# Altium schematic sheet Y2.SchDoc
size A1; SheetNumber: 1; SheetTotal: 1
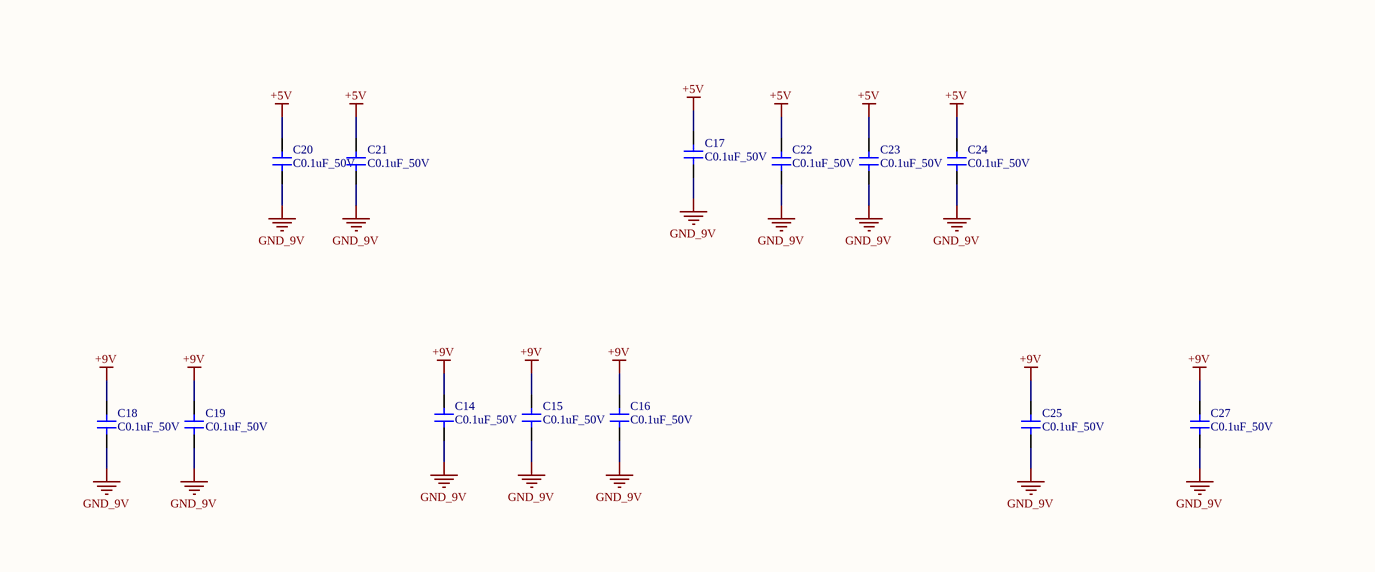
[diagram p0: Y2.SchDoc, top left]
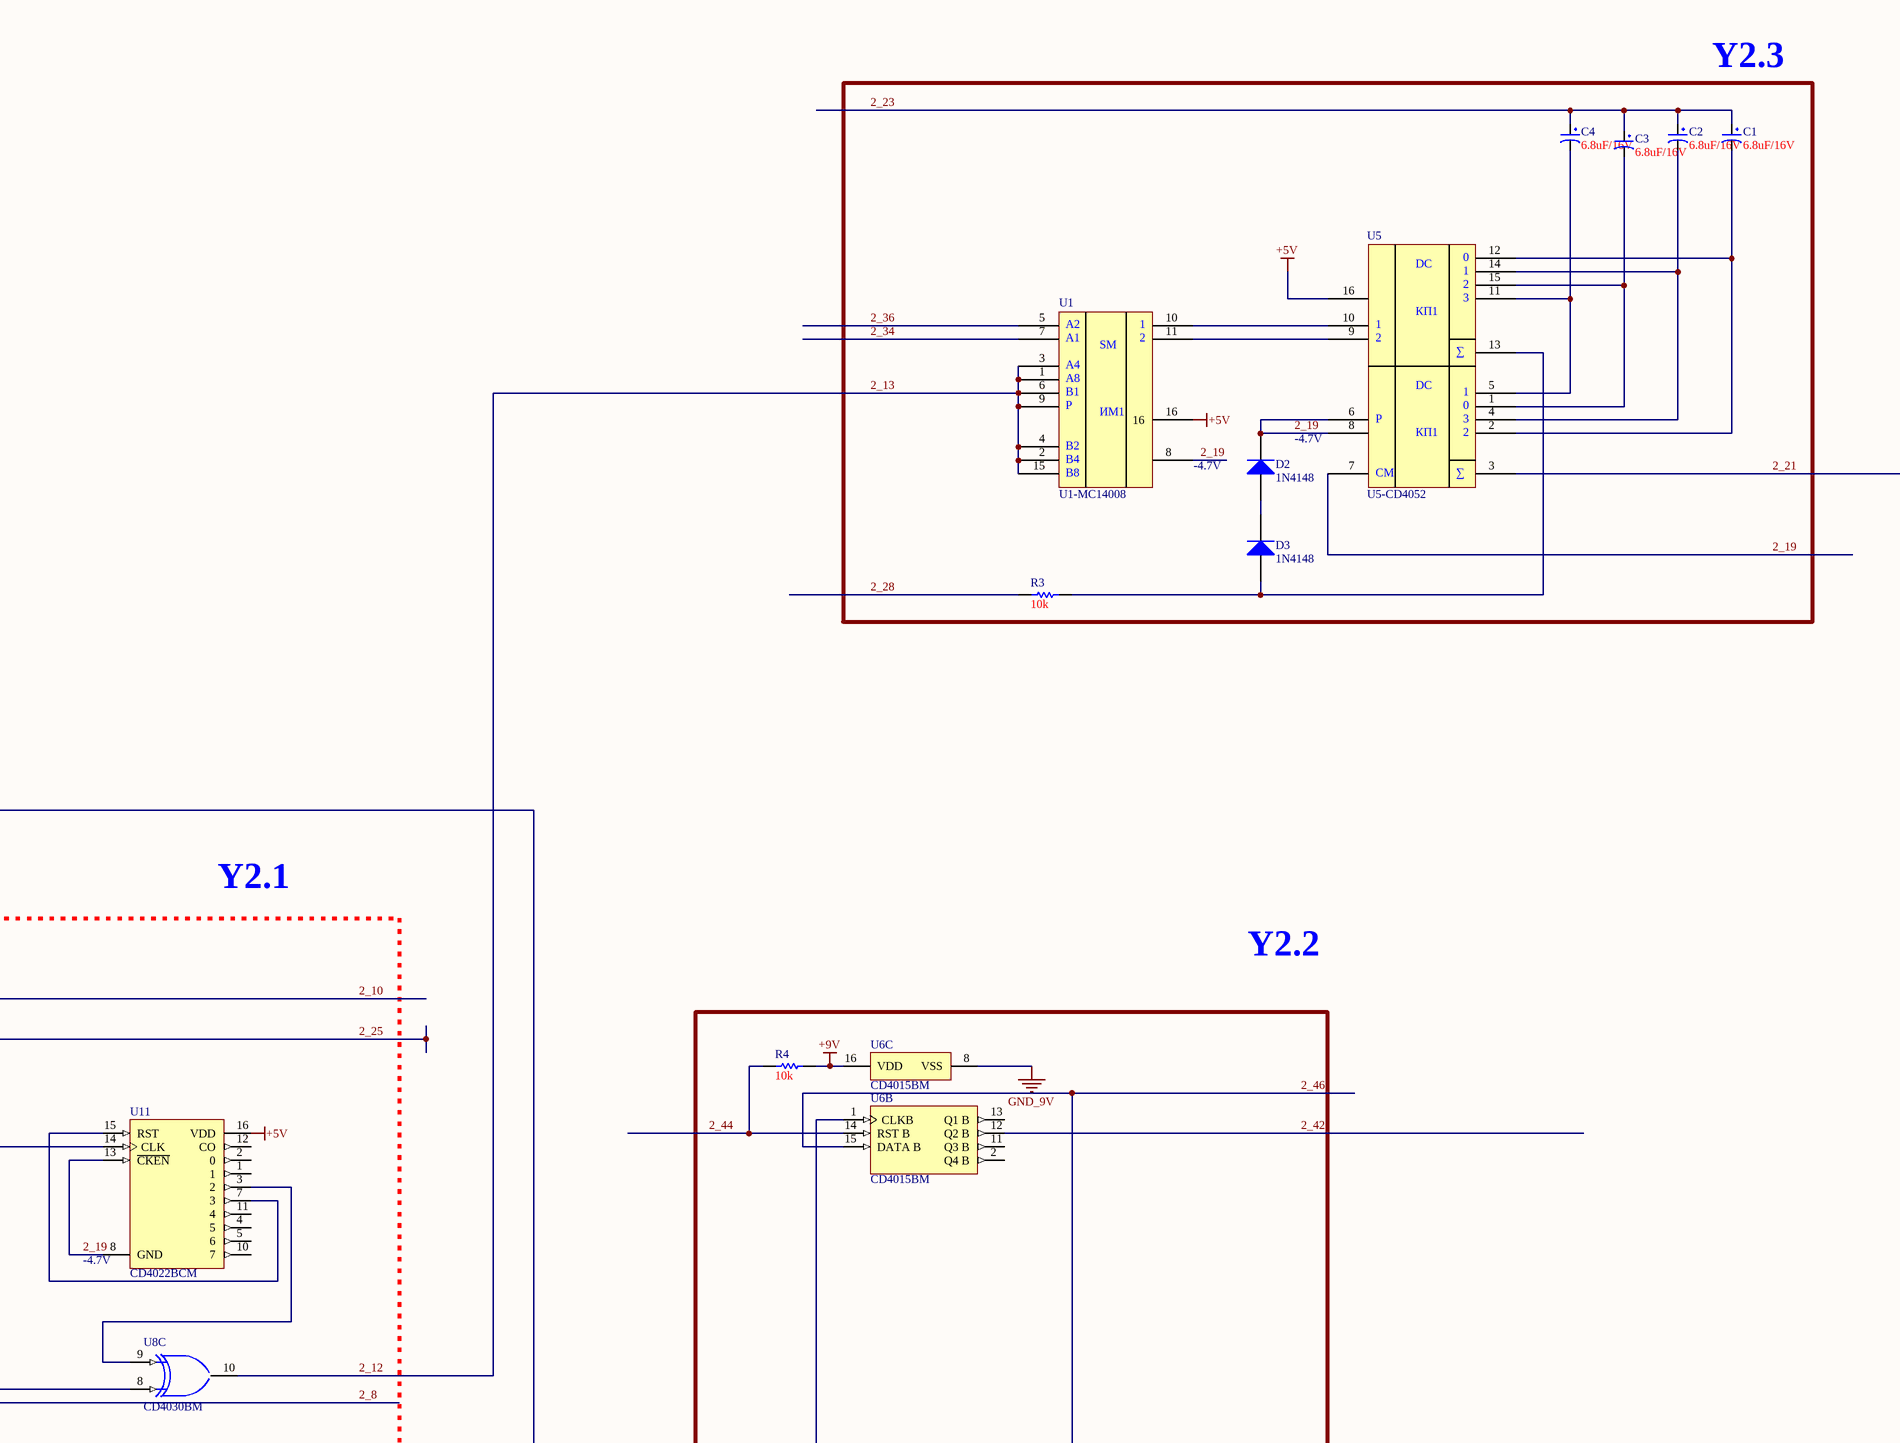
[diagram p1: Y2.SchDoc, top right]
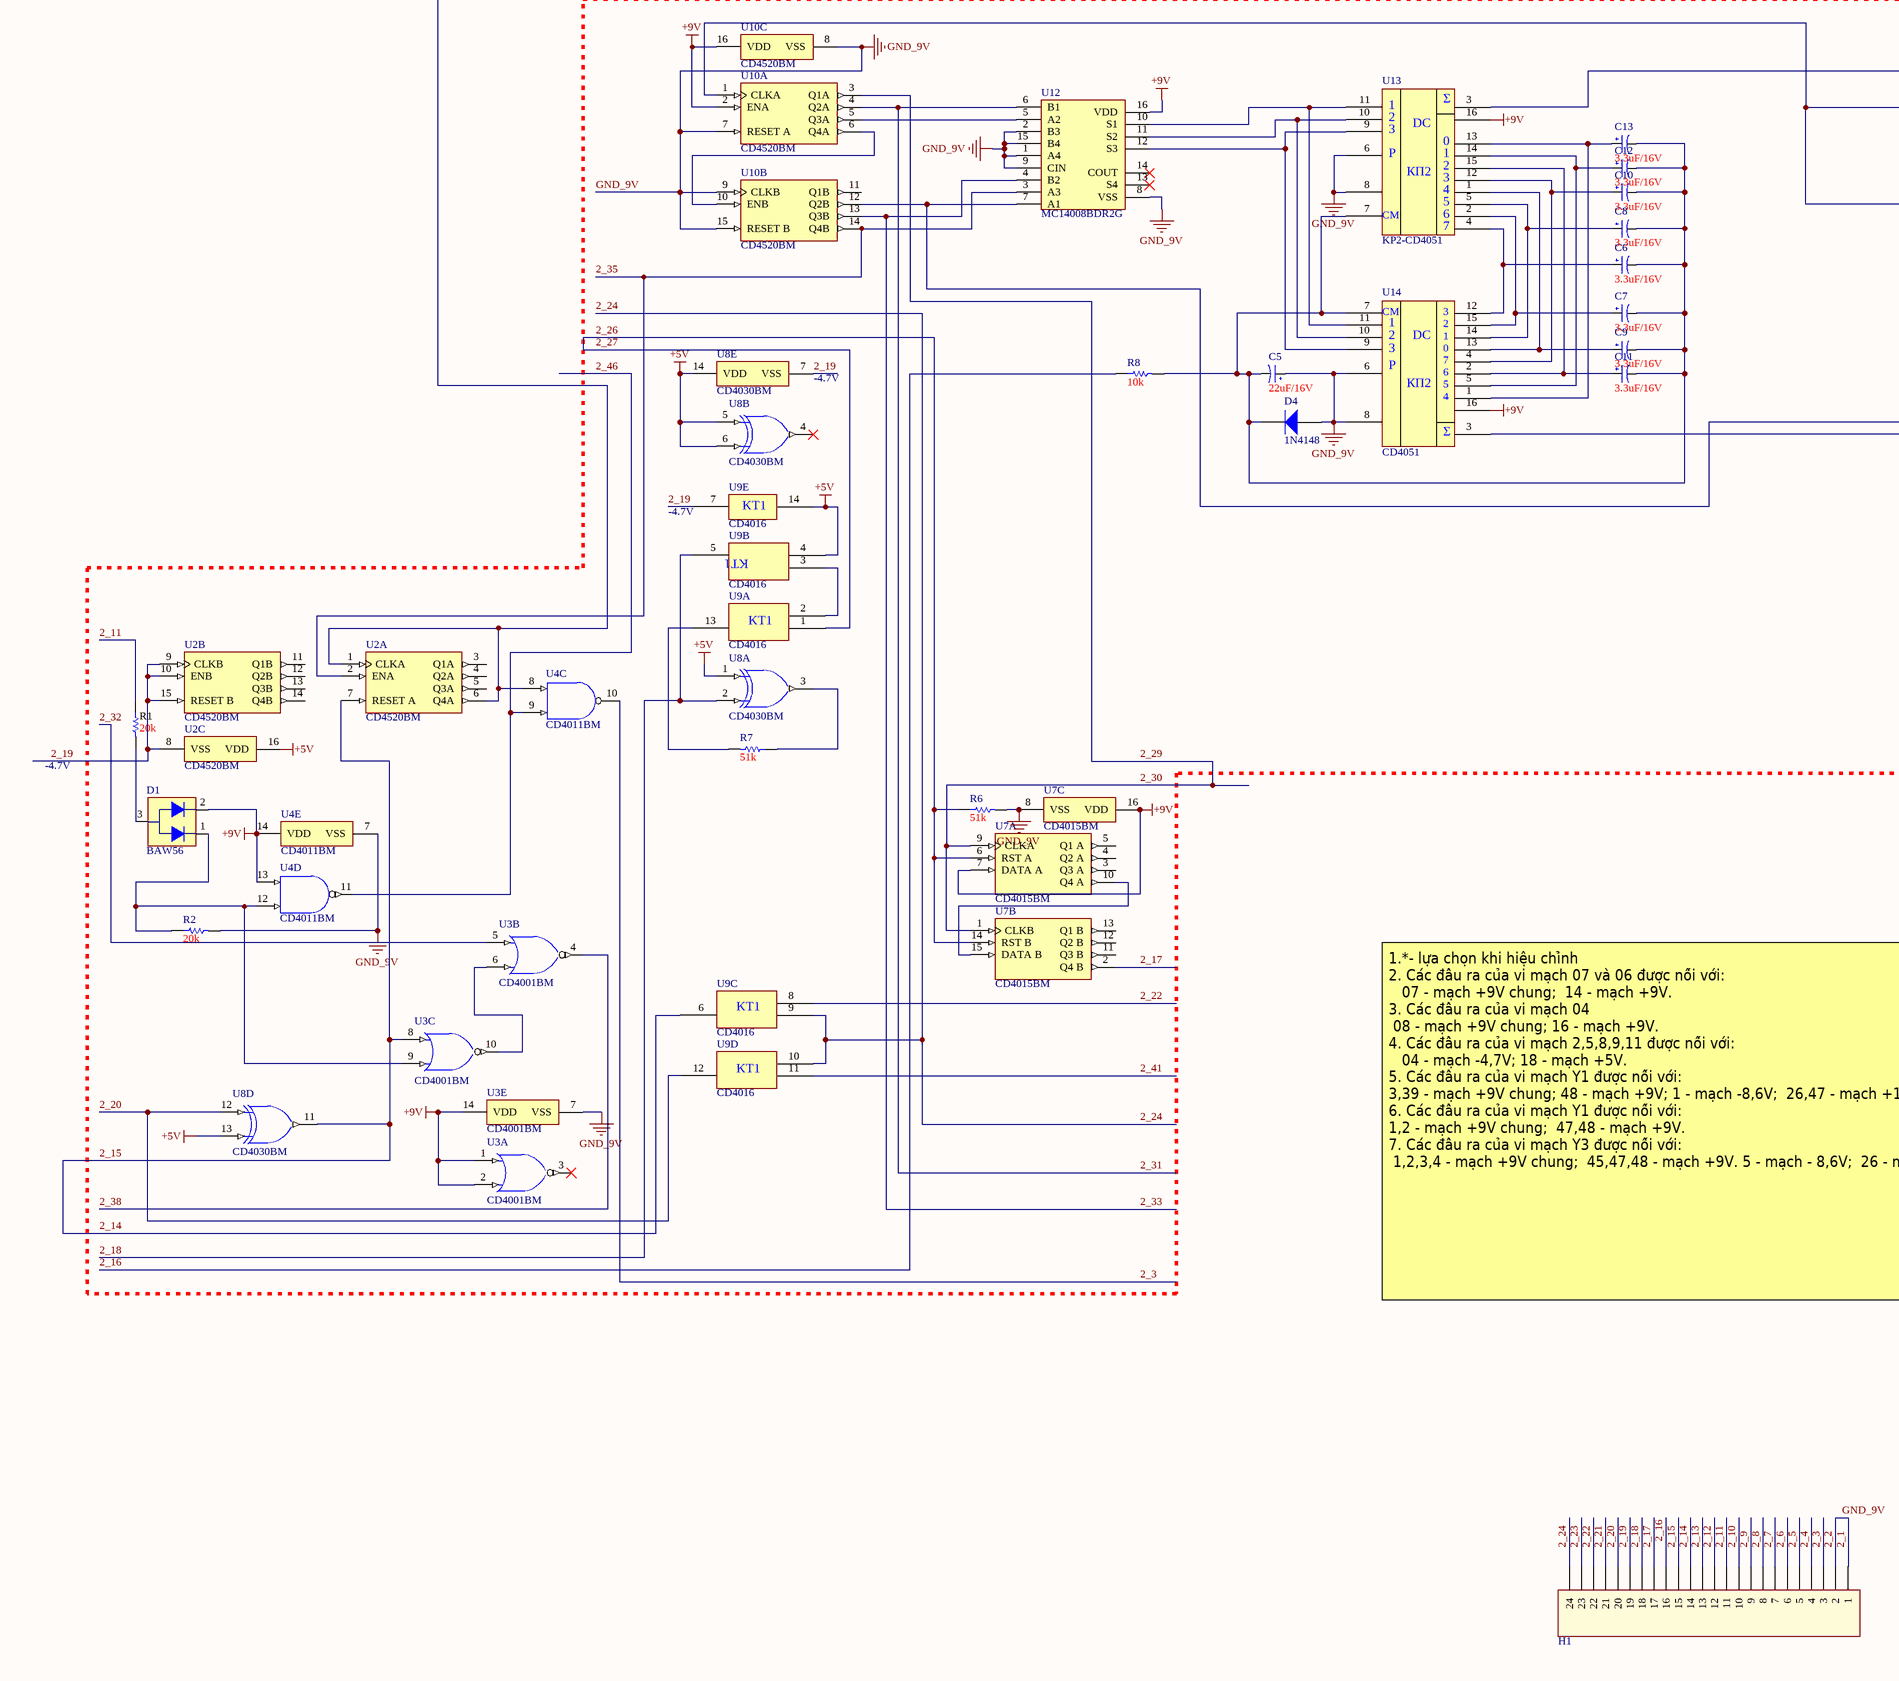
[diagram p2: Y2.SchDoc, bottom left]
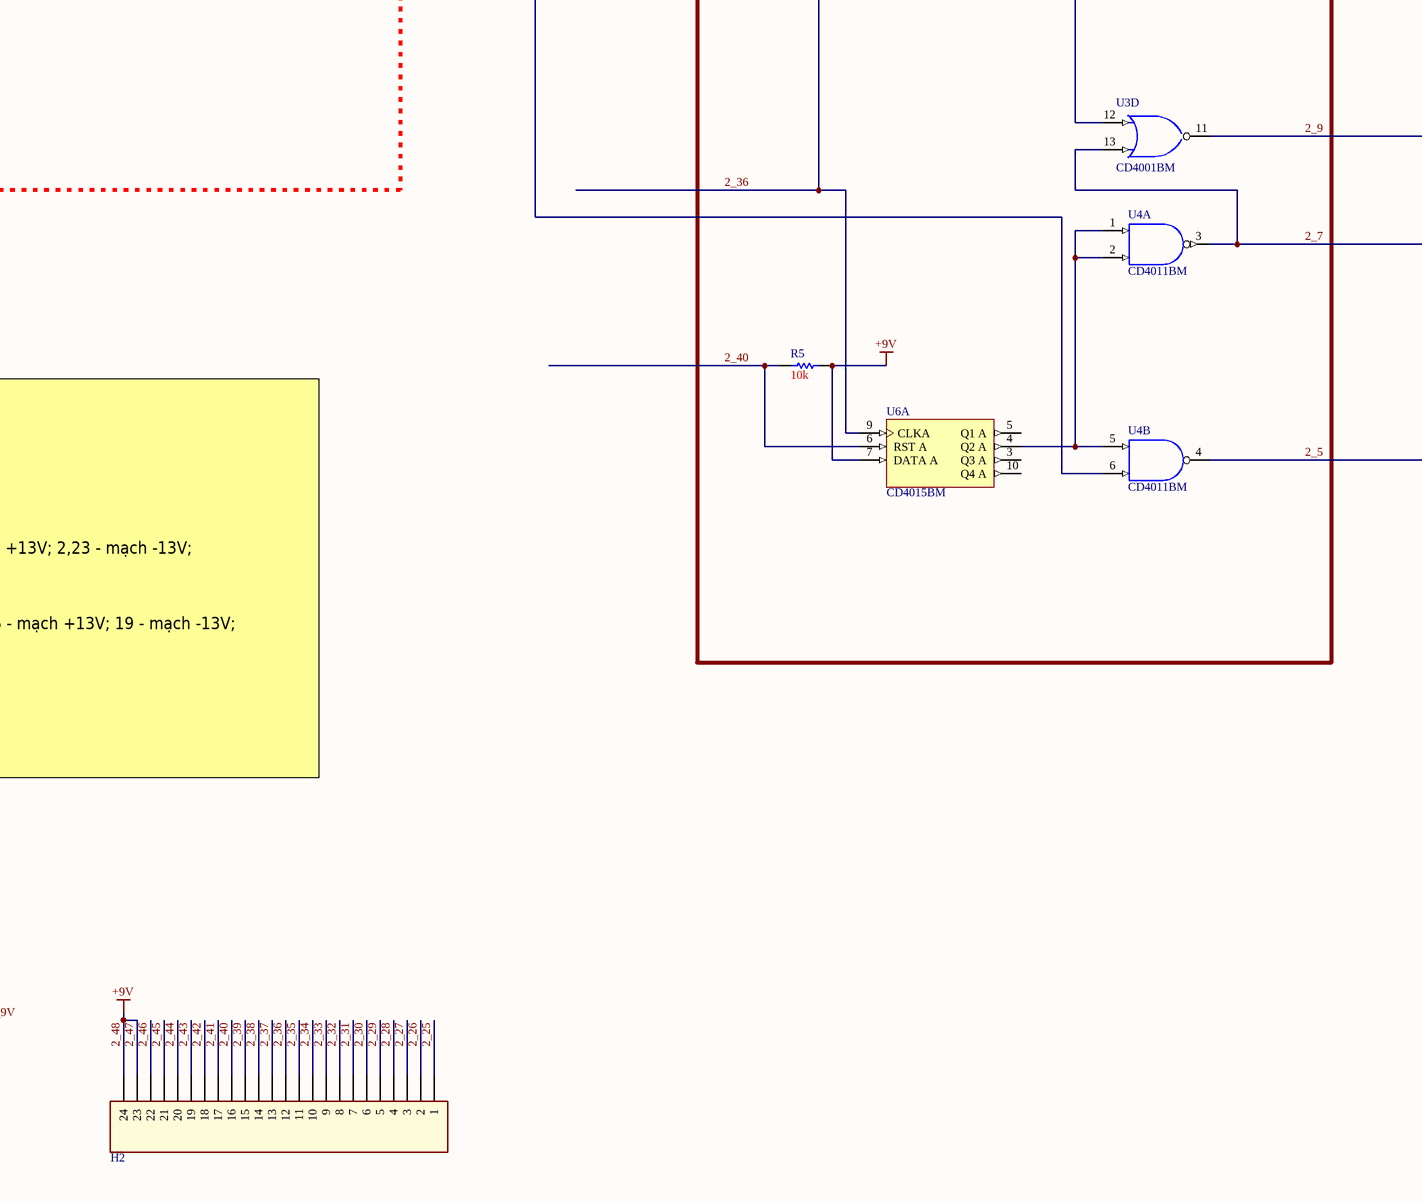
[diagram p3: Y2.SchDoc, bottom right]

## Parts
C1  6.8uF/16V  [3216]
C2  6.8uF/16V  [3216]
C3  6.8uF/16V  [3216]
C4  6.8uF/16V  [3216]
C5  22uF/16V  [3528]
C6  3.3uF/16V  [3216]
C7  3.3uF/16V  [3216]
C8  3.3uF/16V  [3216]
C9  3.3uF/16V  [3216]
C10  3.3uF/16V  [3216]
C11  3.3uF/16V  [3216]
C12  3.3uF/16V  [3216]
C13  3.3uF/16V  [3216]
C14  C0.1uF_50V  [C0805]
C15  C0.1uF_50V  [C0805]
C16  C0.1uF_50V  [C0805]
C17  C0.1uF_50V  [C0805]
C18  C0.1uF_50V  [C0805]
C19  C0.1uF_50V  [C0805]
C20  C0.1uF_50V  [C0805]
C21  C0.1uF_50V  [C0805]
C22  C0.1uF_50V  [C0805]
C23  C0.1uF_50V  [C0805]
C24  C0.1uF_50V  [C0805]
C25  C0.1uF_50V  [C0805]
C27  C0.1uF_50V  [C0805]
D1  BAW56  [sot-23]
D2  1N4148  [SOD123]
D3  1N4148  [SOD123]
D4  1N4148  [SOD123]
H1  Header 24  [header 24]  (value not drawn)
H2  Header 24  [header 24]  (value not drawn)
R1  20k  [R0805]
R2  20k  [R0805]
R3  10k  [C0805]
R4  10k  [R0805]
R5  10k  [R0805]
R6  51k  [R0805]
R7  51k  [C0805]
R8  10k  [1206]
U1  U1-MC14008  [soic16n]
U2  CD4520BM  [D0016A_N]  (parts A,B,C of 3)
U3  CD4001BM  [D0014A_N]  (parts A,B,C,D,E of 5)
U4  CD4011BM  [D0014A_N]  (parts A,B,C,D,E of 5)
U5  U5-CD4052  [soic16n]
U6  CD4015BM  [D0016A_N]  (parts A,B,C of 3)
U7  CD4015BM  [D0016A_N]  (parts A,B,C of 3)
U8  CD4030BM  [D0014A_N]  (parts A,B,C,D,E of 5)
U9  CD4016  [SOIC14]  (parts A,B,C,D,E of 5)
U10  CD4520BM  [D0016A_N]  (parts A,B,C of 3)
U11  CD4022BCM  [SOP16]
U12  MC14008BDR2G  [SOIC127P600X175-16N]
U13  KP2-CD4051  [soic16n]
U14  CD4051  [soic16n]

## Blocks framed on the sheet
Y2.3: C1-C4 D2 D3 R3 U1 U5

## Nets
2_1: C5.1 C14.1 C15.1 C16.1 C17.1 C18.1 C19.1 C20.1 C21.1 C22.1 C23.1 C24.1 C25.1 C27.1 D4.1(A) H1.1 H1.2 R2.2 R6.2 U3.7(VSS) U4.7(VSS) U6.8(VSS) U7.8(VSS) U10.7(RESET_A) U10.8(VSS) U10.9(CLKB) U10.15(RESET_B) U12.1(A4) U12.2(B3) U12.8(VSS) U12.9(CIN) U12.15(B4) U13.6 U13.8 U14.6 U14.8  [also labelled 2_2, GND_9V]
2_47: C14.2 C15.2 C16.2 C18.2 C19.2 C25.2 C27.2 D1.2 H2.23 H2.24 R4.2 R5.1 U3.1(A) U3.2(B) U3.14(VDD) U4.13(H) U4.14(VDD) U6.7(DATA_A) U6.16(VDD) U7.7(DATA_A) U7.16(VDD) U10.2(ENA) U10.16(VDD) U12.16(VDD) U13.16 U14.16  [also labelled +9V, 2_48]
+5V: C17.2 C20.2 C21.2 C22.2 C23.2 C24.2 U1.16 U2.16(VDD) U5.16 U8.1(A) U8.5(C) U8.6(D) U8.13(H) U8.14(VDD) U9.4 U9.14 U11.16(VDD)
2_3: H1.3 U4.10(L)
2_4: H1.4
2_5: H1.5 U4.4(K)
2_6: H1.6
2_7: H1.7 U3.13(H) U4.3(J)
2_8: H1.8 U14.3
2_9: H1.9 U3.11(M)
2_10: H1.10 U13.3
2_11: H1.11 R1.1
2_12: H1.12 H1.13 U1.1 U1.2 U1.3 U1.4 U1.6 U1.9 U1.15 U8.10(L)  [also labelled 2_13]
2_14: H1.14 H1.15 U2.7(RESET_A) U3.8(E) U8.11(M) U9.6  [also labelled 2_15]
2_16: H1.16 R8.1
2_17: H1.17 U7.2(Q4_B)
2_18: H1.18 U8.2(B) U9.5
2_19: D2.2(K) H1.19 U1.8 U2.8(VSS) U2.9(CLKB) U2.10(ENB) U2.15(RESET_B) U5.6 U5.7 U5.8 U8.7(VSS) U9.7 U11.8(GND) U11.13(~{CKEN})
2_20: H1.20 U8.12(G) U9.12
2_21: H1.21 U5.3
2_22: H1.22 U9.8
2_23: C1.1 C2.1 C3.1 C4.1 H1.23
2_24: H1.24 U9.9 U9.10
2_25: H2.1 U10.1(CLKA) U11.14(CLK)
2_26: H2.2 H2.3 R6.1 U7.6(RST_A) U7.14(RST_B) U9.1  [also labelled 2_27]
2_28: H2.4 R3.2
2_29: H2.5 H2.6 U7.1(CLKB) U7.9(CLKA) U10.3(Q1A)  [also labelled 2_30]
2_31: H2.7 U10.4(Q2A) U12.6(B1)
2_32: H2.8 U3.5(C)
2_33: H2.9 U10.13(Q3B) U12.4(B2)
2_34: H2.10 U1.7
2_35: H2.11 U2.2(ENA) U10.14(Q4B) U12.3(A3)
2_36: H2.12 U1.5 U6.1(CLKB) U6.9(CLKA)
2_37: H2.13
2_38: H2.14 U3.4(K)
2_39: H2.15
2_40: H2.16 R5.2 U6.6(RST_A)
2_41: H2.17 U9.11
2_42: H2.18 U6.12(Q2_B)
2_43: H2.19
2_44: H2.20 R4.1 U6.14(RST_B)
2_45: H2.21
2_46: H2.22 U3.12(G) U4.9(F) U4.11(M) U6.15(DATA_B)
NetC1_2: C1.2 U5.2 U5.12
NetC2_2: C2.2 U5.4 U5.14
NetC3_2: C3.2 U5.1 U5.15
NetC4_2: C4.2 U5.5 U5.11
NetC5_2: C5.2 C6.2 C7.2 C8.2 C9.2 C10.2 C11.2 C12.2 C13.2 D4.2(K) R8.2 U13.7 U14.7
NetC6_1: C6.1 U13.4 U14.12
NetC7_1: C7.1 U13.2 U14.15
NetC8_1: C8.1 U13.5 U14.14
NetC9_1: C9.1 U13.1 U14.13
NetC10_1: C10.1 U13.12 U14.4
NetC11_1: C11.1 U13.15 U14.2
NetC12_1: C12.1 U13.14 U14.5
NetC13_1: C13.1 U13.13 U14.1
NetD1_1: D1.1 R2.1 U3.9(F) U4.12(G)
NetD1_3: D1.3 R1.2
NetD2_1: D2.1(A) D3.2(K)
NetD3_1: D3.1(A) R3.1 U5.13
NetR7_1: R7.1 U8.3(J)
NetR7_2: R7.2 U9.13
NetU1_10: U1.10 U5.10
NetU1_11: U1.11 U5.9
NetU2_1: U2.1(CLKA) U2.6(Q4A) U4.6(D) U4.8(E)
NetU3_6: U3.6(D) U3.10(L)
NetU4_1: U4.1(A) U4.2(B) U4.5(C) U6.4(Q2_A)
NetU7_10: U7.10(Q4_A) U7.15(DATA_B)
NetU8_8: U8.8(E) U10.12(Q2B) U12.7(A1)
NetU8_9: U8.9(F) U11.3(2)
NetU9_2: U9.2 U9.3
NetU10_5: U10.5(Q3A) U12.5(A2)
NetU10_6: U10.6(Q4A) U10.10(ENB)
NetU11_7: U11.7(3) U11.15(RST)
NetU12_10: U12.10(S1) U13.11 U14.11
NetU12_11: U12.11(S2) U13.10 U14.10
NetU12_12: U12.12(S3) U13.9 U14.9

Not connected (* = marked no-connect by the designer): U2 3(Q1A) 4(Q2A) 5(Q3A) 11(Q1B) 12(Q2B) 13(Q3B) 14(Q4B); U3 3(J)*; U6 2(Q4_B) 3(Q3_A) 5(Q1_A) 10(Q4_A) 11(Q3_B) 13(Q1_B); U7 3(Q3_A) 4(Q2_A) 5(Q1_A) 11(Q3_B) 12(Q2_B) 13(Q1_B); U8 4(K)*; U10 11(Q1B); U11 1 2(0) 4(5) 5(6) 10(7) 11(4) 12(CO); U12 13(S4)* 14(COUT)*

## Notes on the sheet
- -4.7V
- Y2.1
- Y2.2
- (near U11) -4.7V
- (near U8) -4.7V
- (near U9) -4.7V
- 1.*- lựa chọn khi hiệu chỉnh
  2. Các đầu ra của vi mạch 07 và 06 được nối với:
  07 - mạch +9V chung; 	14 - mạch +9V.
  3. Các đầu ra của vi mạch 04
  08 - mạch +9V chung;	16 - mạch +9V.
  4. Các đầu ra của vi mạch 2,5,8,9,11 được nối với:
  04 - mạch -4,7V; 18 - mạch +5V.
  5. Các đầu ra của vi mạch Y1 được nối với:
  3,39 - mạch +9V chung; 48 - mạch +9V; 1 - mạch -8,6V; 	26,47 - mạch +13V;	2,23 - mạch -13V;
  6. Các đầu ra của vi mạch Y1 được nối với:
  1,2 - mạch +9V chung; 	47,48 - mạch +9V.
  7. Các đầu ra của vi mạch Y3 được nối với:
  1,2,3,4 - mạch +9V chung; 	45,47,48 - mạch +9V. 5 - mạch - 8,6V; 	26 - mạch +13V;	19 - mạch -13V;
- (in symbol CD4016, part A) KT1
- (in symbol CD4016, part B) KT1
- (in symbol CD4016, part C) KT1
- (in symbol CD4016, part D) KT1
- (in symbol CD4016, part E) KT1
- (in symbol CD4051) CM; DC; 0; P; КП2; Σ
- (in symbol KP2-CD4051) Σ; DC; 0; P; КП2; CM
- (in symbol U1-MC14008) A2; A1; SM; A4; A8; B1; P; ИМ1; B2; B4; B8
- (in symbol U5-CD4052) 0; DC; КП1; ∑; P; CM

## Library data of the parts
C1-C4 = CP2: C 47uF/50V , 220uF/16V; Value: 47uF/16 - 50V; Description 1: 470uF/6,3V - 330uF/10V - 220uF/16V; Description 2: 100uF/25V - 35V - 47uF/50V - 22uF/100V; Description 3: 33uF => 47uF/63V - 1uF => 4,7uF/160V; Description 4: 1uF => 2,2uF/250V - 1uF/350V
C5-C13 = CP1: Cap P  0,1uF < 22uF , 16 - 50V; Value: 10uF/50V; Description 1: 10 => 220uF/6,3V/10V - 10uF => 100uF/16V; Description 2: 0,1uF => 33uF/50V - 10uF => 22uF/63V; Description 3: 0,47uF => 10uF/100V
D1 = UF3
D2-D4 = Diode S4: Dán; Ten_Linh_Kien: Diode S4 SOD123 ( 1N5819 SOD123); Ma_Hang: MH005519; Don_Vi: Con; Ghi_Chu: *; Chung_Loai: Dán; Kieu_Chan: *
R1-R8 = Res: Standard resistor; ASiD Part Number: Res-AS
  R1 R2: Value: 20k
  R3-R5 R8: Value: 10k
  R6 R7: Value: 51k
U2 U10 = CD4520BM: CMOS Dual Binary Up-Counter, D0016A, TUBE; Manufacturer: Texas Instruments; VCC(Max)(V): 18; VCC(Min)(V): 3; Inputs: 1; ICC @ Nom Voltage(Max)(mA): 0.03; Bits(#): 4; F @ Nom Voltage(Max)(Mhz): 8; Rating: Catalog; Technology Family: CD4000; Voltage(Nom)(V): 5,10,15; Schmitt Trigger: No; Output Drive (IOL/IOH)(Max)(mA): 1.5/-1.5; tpd @ Nom Voltage(Max)(ns): 230; DatasheetVersion: SCHS076D; PackageReference: D0016A; Supplier 1: Mouser; Supplier Part Number 1: 595-CD4520BM; Supplier 2: Digi-Key; Supplier Part Number 2: 296-32927-5-ND; Generic Part Number: CD4520B; Output Type: CMOS; Function: Counter; Input Type: CMOS; Operating Temperature Range(C): -55 to 125; Type: Binary; Code_JEDEC: MS-012 variation AC; PartNumber: CD4520BM; ComponentLink1Description: Manufacturer URL; ComponentLink1URL: http://www.ti.com/; ComponentLink2Description: Datasheet; ComponentLink2URL: http://www.ti.com/lit/ds/symlink/cd4520b.pdf; ComponentLink3Description: Package Specification; ComponentLink3URL: http://www.ti.com/lit/ml/mpds178g/mpds178g.pdf
U3 = CD4001BM: CMOS Quad 2-Input NOR Gate, D0014A, TUBE; Manufacturer: Texas Instruments; VCC(Min)(V): 3; VCC(Max)(V): 18; Bits(#): 4; Rating: Military; tpd @ Nom Voltage(Max)(ns): 120; ICC @ Nom Voltage(Max)(mA): 0.015; F @ Nom Voltage(Max)(Mhz): 8; Voltage(Nom)(V): 10; Output Drive (IOL/IOH)(Max)(mA): 1.5/-1.5; DatasheetVersion: SCHS015C; PackageReference: D0014A; Generic Part Number: CD4001B; Output Type: CMOS; Input Type: CMOS; Operating Temperature Range(C): -55 to 125; Code_JEDEC: MS-012; PartNumber: CD4001BM; ComponentLink1Description: Manufacturer URL; ComponentLink1URL: http://www.ti.com/; ComponentLink2Description: Datasheet; ComponentLink2URL: http://www.ti.com/lit/ds/symlink/cd4001b.pdf; ComponentLink3Description: Package Specification; ComponentLink3URL: http://www.ti.com/lit/ml/mpds177g/mpds177g.pdf
U4 = CD4011BM: CMOS Quad 2-Input NAND Gate, D0014A, TUBE; Manufacturer: Texas Instruments; VCC(Max)(V): 18; VCC(Min)(V): 3; ICC @ Nom Voltage(Max)(mA): 0.015; Bits(#): 4; F @ Nom Voltage(Max)(Mhz): 8; Rating: Military; Technology Family: CD4000; Voltage(Nom)(V): 10; Schmitt Trigger: No; Output Drive (IOL/IOH)(Max)(mA): 1.5/-1.5; DatasheetVersion: SCHS021D; PackageReference: D0014A; Supplier 1: Mouser; Supplier Part Number 1: 595-CD4011BM; Supplier 2: Digi-Key; Supplier Part Number 2: 296-3507-5-ND; Generic Part Number: CD4011B; Output Type: CMOS; Input Type: CMOS; Operating Temperature Range(C): -55 to 125; Code_JEDEC: MS-012; PartNumber: CD4011BM; ComponentLink1Description: Manufacturer URL; ComponentLink1URL: http://www.ti.com/; ComponentLink2Description: Datasheet; ComponentLink2URL: http://www.ti.com/lit/ds/symlink/cd4011b.pdf; ComponentLink3Description: Package Specification; ComponentLink3URL: http://www.ti.com/lit/ml/mpds177g/mpds177g.pdf
U6 U7 = CD4015BM: CMOS Dual 4-Stage Static Shift Register, D0016A, TUBE; Manufacturer: Texas Instruments; Technology Family: CD4000; VCC(Min)(V): 3; VCC(Max)(V): 18; Voltage(Nom)(V): 10; F @ Nom Voltage(Max)(Mhz): 8; ICC @ Nom Voltage(Max)(mA): 0.3; tpd @ Nom Voltage(Max)(ns): 160; Output Drive (IOL/IOH)(Max)(mA): 1.5/-1.5; 3-State Output: No; Rating: Catalog; Bits: 4; DatasheetVersion: SCHS025D; PackageReference: D0016A; Generic Part Number: CD4015B; Input Type: CMOS; Output Type: CMOS; Operating Temperature Range(C): -55 to 125; Code_JEDEC: MS-012 variation AC; PartNumber: CD4015BM; ComponentLink1Description: Manufacturer URL; ComponentLink1URL: http://www.ti.com/; ComponentLink2Description: Datasheet; ComponentLink2URL: http://www.ti.com/lit/ds/symlink/cd4015b.pdf; ComponentLink3Description: Package Specification; ComponentLink3URL: http://www.ti.com/lit/ml/mpds178g/mpds178g.pdf
U8 = CD4030BM: CMOS Quad Exclusive-OR Gate, D0014A, TUBE; Manufacturer: Texas Instruments; VCC(Max)(V): 18; VCC(Min)(V): 3; ICC @ Nom Voltage(Max)(mA): 0.015; Bits(#): 4; F @ Nom Voltage(Max)(Mhz): 8; Rating: Military; Technology Family: CD4000; Voltage(Nom)(V): 10; Schmitt Trigger: No; Output Drive (IOL/IOH)(Max)(mA): 1.5/-1.5; tpd @ Nom Voltage(Max)(ns): 130; DatasheetVersion: SCHS035C; PackageReference: D0014A; Supplier 1: Mouser; Supplier Part Number 1: 595-CD4030BM; Supplier 2: Digi-Key; Supplier Part Number 2: 296-14263-5-ND; Generic Part Number: CD4030B; Output Type: CMOS; Input Type: CMOS; Operating Temperature Range(C): -55 to 125; PartNumber: CD4030BM; ComponentLink1Description: Manufacturer URL; ComponentLink1URL: http://www.ti.com/; ComponentLink2Description: Datasheet; ComponentLink2URL: http://www.ti.com/lit/ds/symlink/cd4030b.pdf
U11 = CD4022BCM: Divide by 8 Counter/Divider with 8 Decoded Outputs; Note: NC pins 6 and 9 are not drawn.; Published: 17-Jul-2002; LatestRevisionDate: 13-Apr-2006; LatestRevisionNote: IPC-7351 Footprint Added.; DatasheetVersion: Jan-1999; PackageVersion: 2000; PackageReference: M16A; Publisher: Altium Limited; PackageDescription: 16-Pin Small Outline Integrated Circuit 1.27 mm Pitch; Code_IPC: SOIC127P600-16; ComponentLink1Description: Manufacturer Link; ComponentLink1URL: http://www.fairchildsemi.com/; ComponentLink2Description: Datasheet; ComponentLink2URL: http://www.fairchildsemi.com/ds/CD%2FCD4017BC.pdf
U12 = MC14008BDR2G: THAY THẾ CD4008; Manufacturer_Name: onsemi; Datasheet Link: https://www.onsemi.com/pub/Collateral/MC14008B-D.PDF; Height: 1.75mm; Manufacturer_Part_Number: MC14008BDR2G; Mouser Part Number: 863-MC14008BDR2G; Mouser Price/Stock: https://www.mouser.co.uk/ProductDetail/onsemi/MC14008BDR2G?qs=k%252B8dvkBktS20Fsy6mJwU%252Bg%3D%3D; Arrow Part Number: MC14008BDR2G; Arrow Price/Stock: https://www.arrow.com/en/products/mc14008bdr2g/on-semiconductor?utm_currency=USD&region=nac